# EAGLE design MAX8606 (EAGLE 7.3.0)
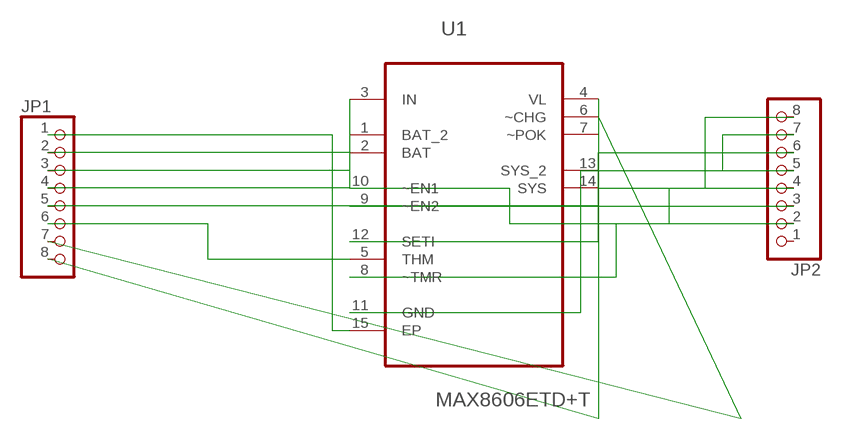
[diagram p0: schematic, sheet 1]

## Parts
JP1  PINHD-1X8CLEANBIG  [1X08-CLEANBIG]
JP2  PINHD-1X8CLEANBIG  [1X08-CLEANBIG]
U1  MAX8606ETD+T  [DFN300X300X80-15N]

## Nets
GND: JP1.1 JP2.5 U1.11(GND) U1.15(EP)
N$1: JP2.8 U1.14(SYS)
N$2: JP2.7 U1.13(SYS_2)
N$3: JP2.6 U1.12(SETI)
N$5: JP2.4 U1.10(~EN1)
N$6: JP2.3 U1.9(~EN2)
N$7: JP2.2 U1.8(~TMR)
N$8: JP1.8 U1.7(~POK)
N$9: JP1.7 U1.6(~CHG)
N$11: JP1.5 U1.4(VL)
N$12: JP1.2 JP1.3 JP1.4 U1.3(IN)
N$13: JP1.6 U1.5(THM)
Unconnected: JP2.1 U1.1(BAT_2) U1.2(BAT)

## Library data of the parts
JP1 JP2 = adafruit:PINHD-1X8: PIN HEADER
U1 = Maxim_By_element14_Batch_1:MAX8606ETD+T: USB/AC Adapter, Li+ Linear Battery Charger with Integrated 50mÙ Battery Switch; MPN: MAX8606ETD+T; OC_FARNELL: 1628234; OC_NEWARK: 68K5050; PACKAGE: DFN-14; SUPPLIER: Maxim

## Board
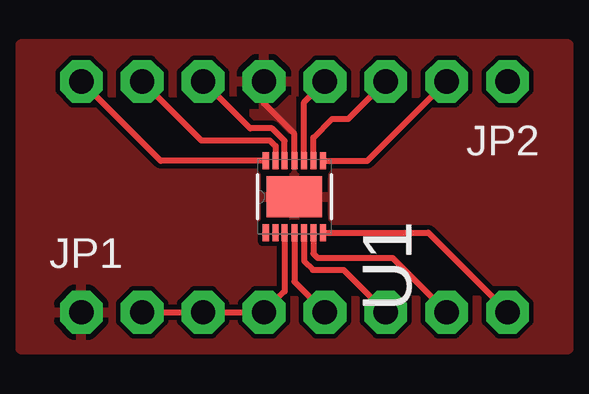
[diagram p1: board, top side]

No outline drawn. Coordinates in mm, seen from the top.
Copper layers (1*16): Top 0.035mm / dielectric 1.5mm / Bottom 0.035mm
Design rules "pcbtrain": minimum track width 0.2mm, minimum drill 0.4mm, track to track 0.2mm, track to pad 0.2mm, pad to pad 0.2mm, via to via 0.2mm, smd to smd 0mil, copper to edge 10mil, drill to drill 0.2mm, minimum pad ring 10mil, minimum via ring 10mil, stop-mask expansion 0.125mm, vias tented up to drill 0mil, thermal gap 10mil

### Footprints (pad centres in the part's own frame; a part is rotated, then mirrored left to right if it is on the bottom)
1X08-CLEANBIG = drill 1.016 pad 1.778 octagon: 1 -8.89,0; 2 -6.35,0; 3 -3.81,0; 4 -1.27,0; 5 1.27,0; 6 3.81,0; 7 6.35,0; 8 8.89,0
DFN300X300X80-15N = smd 0.711 x 0.254: 1 -1.499,1.194; 2 -1.499,0.787; 3 -1.499,0.406; 4 -1.499,0; 5 -1.499,-0.406; 6 -1.499,-0.787; 7 -1.499,-1.194; 8 1.499,-1.194; 9 1.499,-0.787; 10 1.499,-0.406; 11 1.499,0; 12 1.499,0.406; 13 1.499,0.787; 14 1.499,1.194 | smd 1.702 x 2.311: 15 0,0

### Placement (x,y rotation side)
JP1  11.43,1.54 0 top
JP2  11.43,11.16 180 top
U1  11.43,6.35 90 top

### Tracks (layer width: path | path; a pad name or v marks a point on that pad's centre or on a via)
GND
  Top 0.254: U1.11 11.43,8.97 10.16,10.24 JP2.5
  pour Top: 0,0 22.86,0 22.86,12.7 0,12.7
N$1
  Top 0.254: U1.14 5.85,7.85 JP2.8
N$2
  Top 0.254: JP2.7 7.54,8.7 10.4,8.7 10.64,8.46 U1.13
N$3
  Top 0.254: U1.12 11.02,8.68 10.5,9.2 9.58,9.2 JP2.6
N$5
  Top 0.254: U1.10 11.84,10.3 JP2.4
N$6
  Top 0.254: U1.9 12.22,8.82 13,9.6 13.68,9.6 JP2.3
N$7
  Top 0.254: U1.8 14.47,7.85 JP2.2
N$8
  Top 0.254: U1.7 17.01,4.85 JP1.8
N$9
  Top 0.254: U1.6 12.22,3.98 12.4,3.8 15.52,3.8 JP1.7
N$11
  Top 0.254: U1.4 11.43,2.81 JP1.5
N$12
  Top 0.254: U1.3 11.02,2.4 JP1.4 JP1.3 JP1.2
N$13
  Top 0.254: U1.5 11.84,3.66 12.2,3.3 13.48,3.3 JP1.6